# Altium project LMG5200.PrjPcb
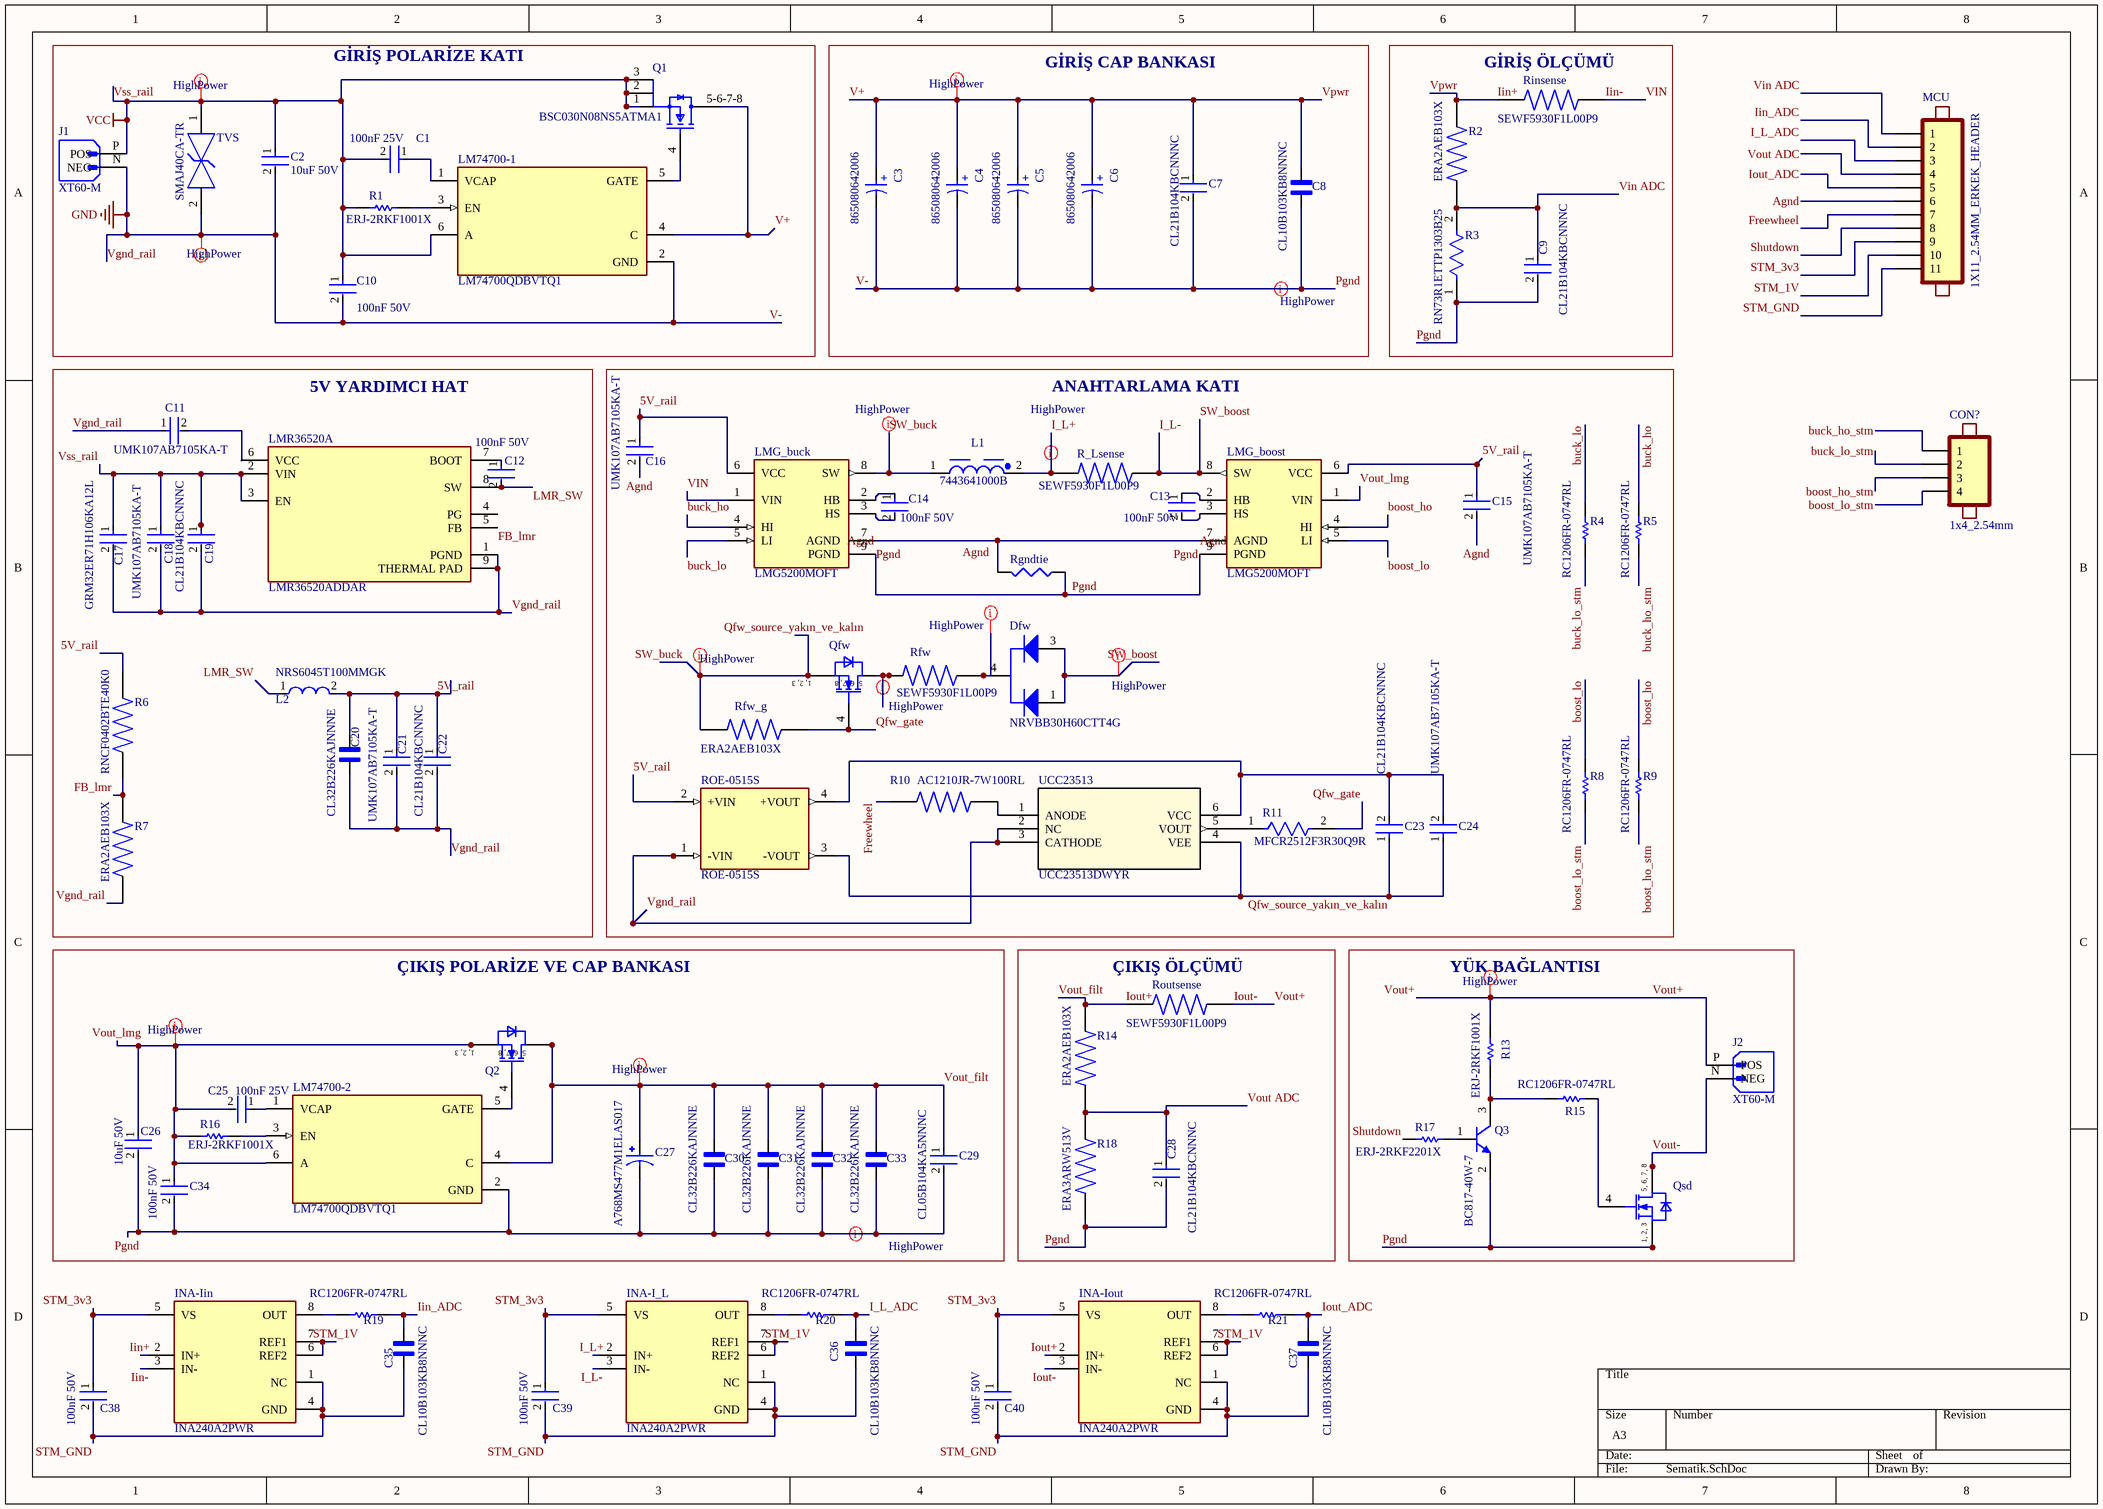
[diagram p0: Sematik.SchDoc]
1 sheet, 89 parts. Net scope: global (net labels, ports and power ports of the same name join across sheets).
Board file: PCB1.PcbDoc

## Sheet Sematik.SchDoc
size A3; SheetNumber: 1; SheetTotal: 1

### Parts
C1  100nF 25V  [FP-CL830-IPC_C]
C2  10uF 50V  [FP-CL31B106KBHNNNE-MFG]
C3  865080642006  [WCAP-ASLI_D5H5.5]
C4  865080642006  [WCAP-ASLI_D5H5.5]
C5  865080642006  [WCAP-ASLI_D5H5.5]
C6  865080642006  [WCAP-ASLI_D5H5.5]
C7  CL21B104KBCNNNC  [FP-CL21-IPC_C]
C8  CL10B103KB8NNNC  [CAPC1608X90N]
C9  CL21B104KBCNNNC  [FP-CL21-IPC_C]
C10  100nF 50V  [FP-CL21-IPC_C]
C11  UMK107AB7105KA-T  [FP-0603-L_1_6_0_15-W_0_8-IPC_C]
C12  100nF 50V  [FP-CL21-IPC_C]
C13  100nF 50V  [FP-CL21-IPC_C]
C14  100nF 50V  [FP-CL21-IPC_C]
C15  UMK107AB7105KA-T  [FP-0603-L_1_6_0_15-W_0_8-IPC_C]
C16  UMK107AB7105KA-T  [FP-0603-L_1_6_0_15-W_0_8-IPC_C]
C17  GRM32ER71H106KA12L  [FP-GRM32-MFG]
C18  UMK107AB7105KA-T  [FP-0603-L_1_6_0_15-W_0_8-IPC_C]
C19  CL21B104KBCNNNC  [FP-CL21-IPC_C]
C20  CL32B226KAJNNNE  [CAPC3225X270N]
C21  UMK107AB7105KA-T  [FP-0603-L_1_6_0_15-W_0_8-IPC_C]
C22  CL21B104KBCNNNC  [FP-CL21-IPC_C]
C23  CL21B104KBCNNNC  [FP-CL21-IPC_C]
C24  UMK107AB7105KA-T  [FP-0603-L_1_6_0_15-W_0_8-IPC_C]
C25  100nF 25V  [FP-CL830-IPC_C]
C26  10uF 50V  [FP-CL31B106KBHNNNE-MFG]
C27  A768MS477M1ELAS017  [CAPAE1030X1225N]
C28  CL21B104KBCNNNC  [FP-CL21-IPC_C]
C29  CL05B104KA5NNNC  [FP-CL830-IPC_C]
C30  CL32B226KAJNNNE  [CAPC3225X270N]
C31  CL32B226KAJNNNE  [CAPC3225X270N]
C32  CL32B226KAJNNNE  [CAPC3225X270N]
C33  CL32B226KAJNNNE  [CAPC3225X270N]
C34  100nF 50V  [FP-CL21-IPC_C]
C35  CL10B103KB8NNNC  [CAPC1608X90N]
C36  CL10B103KB8NNNC  [CAPC1608X90N]
C37  CL10B103KB8NNNC  [CAPC1608X90N]
C38  100nF 50V  [FP-CL21-IPC_C]
C39  100nF 50V  [FP-CL21-IPC_C]
C40  100nF 50V  [FP-CL21-IPC_C]
CON?  1x4_2.54mm  [HDR254M-1X4]
Dfw  NRVBB30H60CTT4G  [ONSC-D2PAK-3-418B-04_V]
INA-I_L  INA240A2PWR  [FP-PW0008A-MFG]
INA-Iin  INA240A2PWR  [FP-PW0008A-MFG]
INA-Iout  INA240A2PWR  [FP-PW0008A-MFG]
J1  XT60-M  [AMASS_XT60-M]
J2  XT60-M  [AMASS_XT60-M]
L1  7443641000B  [WE-HCF_2818]
L2  NRS6045T100MMGK  [FP-NR6045-MFG]
LM74700-1  LM74700QDBVTQ1  [FP-DBV0006A-MFG]
LM74700-2  LM74700QDBVTQ1  [FP-DBV0006A-MFG]
LMG_boost  LMG5200MOFT  [FP-MOF0009A-MFG]
LMG_buck  LMG5200MOFT  [FP-MOF0009A-MFG]
LMR36520A  LMR36520ADDAR  [FP-DDA0008E-IPC_A]
MCU  1X11_2.54MM_ERKEK_HEADER  [254HEADER_1x11_ERKEK_HEADER_180C]
Q1  BSC030N08NS5ATMA1  [FP-PG-TDSON-8-MFG]
Q2  BSC014N06NS  [INF-PG-TDSON-8-FL]  (value not drawn)
Q3  BC817-40W-7  [DIOD-SOT323-3_V]
Qfw  BSC014N06NS  [INF-PG-TDSON-8-FL]  (value not drawn)
Qsd  BSC014N06NS  [INF-PG-TDSON-8-FL]  (value not drawn)
R1  ERJ-2RKF1001X  [RESC1005X40X25NL05T05]
R2  ERA2AEB103X  [RES_ERA2AEB103X]
R3  RN73R1ETTP1303B25  [FP-RN73R1E-IPC_B]
R4  RC1206FR-0747RL  [RESC3116X65X40LL10T20]
R5  RC1206FR-0747RL  [RESC3116X65X40LL10T20]
R6  RNCF0402BTE40K0  [RESC1005X35N]
R7  ERA2AEB103X  [RES_ERA2AEB103X]
R8  RC1206FR-0747RL  [RESC3116X65X40LL10T20]
R9  RC1206FR-0747RL  [RESC3116X65X40LL10T20]
R10  AC1210JR-7W100RL  [RESC3126X65N]
R11  MFCR2512F3R30Q9R  [FP-RMCF2512-IPC_C]
R13  ERJ-2RKF1001X  [RESC1005X40X25NL05T05]
R14  ERA2AEB103X  [RES_ERA2AEB103X]
R15  RC1206FR-0747RL  [RESC3116X65X40LL10T20]
R16  ERJ-2RKF1001X  [RESC1005X40X25NL05T05]
R17  ERJ-2RKF2201X  [RESC1005X40X25LL05T05]
R18  ERA3ARW513V  [RES_ERA3ARW513V]
R19  RC1206FR-0747RL  [RESC3116X65X40LL10T20]
R20  RC1206FR-0747RL  [RESC3116X65X40LL10T20]
R21  RC1206FR-0747RL  [RESC3116X65X40LL10T20]
R_Lsense  SEWF5930F1L00P9  [RESC15077X155N]
Rfw  SEWF5930F1L00P9  [RESC15077X155N]
Rfw_g  ERA2AEB103X  [RES_ERA2AEB103X]
Rgndtie  (no value)  [RES_0402]
Rinsense  SEWF5930F1L00P9  [RESC15077X155N]
ROE-0515S  ROE-0515S  [CONV_ROE-0515S]
Routsense  SEWF5930F1L00P9  [RESC15077X155N]
TVS  SMAJ40CA-TR  [FP-SMA-MFG]
UCC23513  UCC23513DWYR  [DWY6_TEX]

### Blocks framed on the sheet
GİRİŞ POLARİZE KATI: C1 C2 C10 J1 LM74700-1 Q1 R1 TVS
GİRİŞ CAP BANKASI: C3-C8
GİRİŞ ÖLÇÜMÜ: C9 R2 R3 Rinsense
5V YARDIMCI HAT: C11 C12 C17-C22 L2 LMR36520A R6 R7
ANAHTARLAMA KATI: C13-C16 C23 C24 Dfw L1 LMG_boost LMG_buck Qfw R4 R5 R8-R11 R_Lsense Rfw Rfw_g Rgndtie ROE-0515S UCC23513
ÇIKIŞ POLARİZE VE CAP BANKASI: C25-C27 C29-C34 LM74700-2 Q2 R16
ÇIKIŞ ÖLÇÜMÜ: C28 R14 R18 Routsense
YÜK BAĞLANTISI: J2 Q3 Qsd R13 R15 R17

### Nets
Pgnd: C2.2 C3.2(N) C4.2(N) C5.2(N) C6.2(N) C7.2 C8.1 C9.2 C10.2 C11.1 C17.2 C18.2 C19.2 C20.1 C21.2 C22.2 C26.2 C27.2 C28.2 C29.2 C30.1 C31.1 C32.1 C33.1 C34.2 J1.N(NEG) LM74700-1.2(GND) LM74700-2.2(GND) LMG_boost.9(PGND) LMG_buck.9(PGND) LMR36520A.1(PGND) LMR36520A.9(THERMAL_PAD) Q3.2(E) Qsd.1(SOURCE) Qsd.2(SOURCE) Qsd.3(SOURCE) R3.1 R7.2 R18.1 Rgndtie.2(BOT) ROE-0515S.1(-VIN) TVS.2 UCC23513.2(NC) UCC23513.3(CATHODE)  [also labelled GND, V-, Vgnd_rail]
Vss_rail: C1.2 C2.1 C10.1 C17.1 C18.1 C19.1 J1.P(POS) LM74700-1.6(A) LMR36520A.2(VIN) LMR36520A.3(EN) Q1.1(S) Q1.2(S) Q1.3(S) R1.1 TVS.1  [also labelled VCC]
5V_rail: C15.1 C16.1 C20.2 C21.1 C22.1 L2.2 LMG_boost.6(VCC) LMG_buck.6(VCC) R6.2 ROE-0515S.2(+VIN)
Agnd: C15.2 C16.2 LMG_boost.7(AGND) LMG_buck.7(AGND) MCU.6 Rgndtie.1(TOP)
boost_ho: LMG_boost.4(HI) R9.1
boost_ho_stm: CON?.3 R9.2
boost_lo: LMG_boost.5(LI) R8.1
boost_lo_stm: CON?.4 R8.2
buck_ho: LMG_buck.4(HI) R5.1
buck_ho_stm: CON?.1 R5.2
buck_lo: LMG_buck.5(LI) R4.1
buck_lo_stm: CON?.2 R4.2
FB_lmr: LMR36520A.5(FB) R6.1 R7.1
Freewheel: MCU.7 R10.1
I_L+: INA-I_L.2(IN+) L1.2 R_Lsense.1
I_L-: Dfw.1(A1) Dfw.3(A2) INA-I_L.3(IN-) LMG_boost.8(SW) R_Lsense.2  [also labelled SW_boost]
I_L_ADC: C36.2 MCU.3 R20.2
Iin+: C3.1(P) C4.1(P) C5.1(P) C6.1(P) C7.1 C8.2 INA-Iin.2(IN+) LM74700-1.4(C) Q1.5-6-7-8(D) R2.2 Rinsense.1  [also labelled V+, Vpwr]
Iin-: INA-Iin.3(IN-) LMG_buck.1(VIN) Rinsense.2  [also labelled VIN]
Iin_ADC: C35.2 MCU.2 R19.2
Iout+: C27.1 C29.1 C30.2 C31.2 C32.2 C33.2 INA-Iout.2(IN+) LM74700-2.4(C) Q2.5(DRAIN) Q2.6(DRAIN) Q2.7(DRAIN) Q2.8(DRAIN) R14.2 Routsense.1  [also labelled Vout_filt]
Iout-: INA-Iout.3(IN-) J2.P(POS) R13.2 Routsense.2  [also labelled Vout+]
Iout_ADC: C37.2 MCU.5 R21.2
LMR_SW: C12.2 L2.1 LMR36520A.8(SW)
Qfw_gate: Qfw.4(GATE) R11.2 Rfw_g.1
Qfw_source_yakın_ve_kalın: C23.1 C24.1 L1.1 LMG_buck.8(SW) Qfw.1(SOURCE) Qfw.2(SOURCE) Qfw.3(SOURCE) Rfw_g.2 ROE-0515S.3(-VOUT) UCC23513.4(VEE)  [also labelled SW_buck]
Shutdown: MCU.8 R17.1
STM_1V: INA-I_L.6(REF2) INA-I_L.7(REF1) INA-Iin.6(REF2) INA-Iin.7(REF1) INA-Iout.6(REF2) INA-Iout.7(REF1) MCU.10
STM_3v3: C38.1 C39.1 C40.1 INA-I_L.5(VS) INA-Iin.5(VS) INA-Iout.5(VS) MCU.9
STM_GND: C35.1 C36.1 C37.1 C38.2 C39.2 C40.2 INA-I_L.1(NC) INA-I_L.4(GND) INA-Iin.1(NC) INA-Iin.4(GND) INA-Iout.1(NC) INA-Iout.4(GND) MCU.11
Vin ADC: C9.1 MCU.1 R2.1 R3.2
Vout ADC: C28.1 MCU.4 R14.1 R18.2
Vout-: J2.N(NEG) Qsd.5(DRAIN) Qsd.6(DRAIN) Qsd.7(DRAIN) Qsd.8(DRAIN)
Vout_lmg: C25.2 C26.1 C34.1 LM74700-2.6(A) LMG_boost.1(VIN) Q2.1(SOURCE) Q2.2(SOURCE) Q2.3(SOURCE) R16.1
NetC1_1: C1.1 LM74700-1.1(VCAP)
NetC11_2: C11.2 LMR36520A.6(VCC)
NetC12_1: C12.1 LMR36520A.7(BOOT)
NetC13_1: C13.1 LMG_boost.2(HB)
NetC13_2: C13.2 LMG_boost.3(HS)
NetC14_1: C14.1 LMG_buck.2(HB)
NetC14_2: C14.2 LMG_buck.3(HS)
NetC23_2: C23.2 C24.2 ROE-0515S.4(+VOUT) UCC23513.6(VCC)
NetC25_1: C25.1 LM74700-2.1(VCAP)
NetDfw_4: Dfw.4(K) Rfw.2
NetINA-I_L_8: INA-I_L.8(OUT) R20.1
NetINA-Iin_8: INA-Iin.8(OUT) R19.1
NetINA-Iout_8: INA-Iout.8(OUT) R21.1
NetLM74700-1_3: LM74700-1.3(EN) R1.2
NetLM74700-1_5: LM74700-1.5(GATE) Q1.4(G)
NetLM74700-2_3: LM74700-2.3(EN) R16.2
NetLM74700-2_5: LM74700-2.5(GATE) Q2.4(GATE)
NetQ3_1: Q3.1(B) R17.2
NetQ3_3: Q3.3(C) R13.1 R15.1
NetQfw_5: Qfw.5(DRAIN) Qfw.6(DRAIN) Qfw.7(DRAIN) Qfw.8(DRAIN) Rfw.1
NetQsd_4: Qsd.4(GATE) R15.2
NetR10_2: R10.2 UCC23513.1(ANODE)
NetR11_1: R11.1 UCC23513.5(VOUT)

Not connected (* = marked no-connect by the designer): LMR36520A 4(PG)

### Layout directives
net class HighPower: I_L+, I_L-, Iin+, Iout+, Iout-, NetDfw_4, NetQfw_5, Pgnd, Qfw_source_yakın_ve_kalın, Vout_lmg, Vss_rail

### Notes on the sheet
- Labels drawn without touching a wire or pin: Agnd, Pgnd
- (in symbol BSC014N06NS) 1, 2, 3; 5, 6, 7, 8
- (in symbol CMP-03913-53914615-2) +

### Library data of the parts
C1 C25 C29 = CMP-13271-001643-1: Cap Ceramic 100nF 25V X7R ±10% SMD 0402 +125°C Paper T/R; Case/Package: 0402; Voltage Rating: 25V; Capacitance: 100nF; Mount: Surface Mount; Voltage Rating (DC): 25V; Thickness: 0.022inch; Min Operating Temperature: -55°C; Width: 0.02inch; Tolerance: 10%; Packaging: Tape and Reel; Max Operating Temperature: 125°C; Length: 0.039inch; Case Code (Imperial): 0402; Case Code (Metric): 1005
C2 C26 = CMP-2000-07530-2: CAP CER 10UF 50V X7R 1206; Manufacturer: Samsung; Manufacturer Part Number: CL31B106KBHNNNE; Tolerance: 10%; Material: Ceramic; Temperature Coefficient: 15%; Temperature Characteristic: X7R; Digikey Description: CAP CER 10UF 50V X7R 1206; Device Class L1: Passive Components; Value: 10uF; Lead Free: Yes; Device Class L3: Ceramic Capacitors; Octopart: https://octopart.com/cl31b106kbhnnne-samsung-30507377; ComponentLink2URL: http://www.samsungsem.com/global/front/downloadcms.do?path=%2F%2Fglobal%2F%2Fsupport%2F%2Fproduct-search%2F%2Fmlcc%2F%2F__icsFiles%2F%2Fafieldfile%2F%2F2019%2F%2F06%2F%2F18&fileName=CL31B106KBHNNNE-19.pdf; Voltage Rating: 50V; Temperature Range Low: -55°C; RoHS: TRUE; Temperature: -55°C to +125°C; Category: Cap; ComponentLink2Description: Datasheet; Automotive: No; Device Class L2: Capacitors; Capacitance: 10uF; Height: 1.8mm; Temperature Range High: +125°C; Package: CL31B106KBHNNNE
C3-C6 = CMP-03913-53914615-2: Alum. Electrolytic Cap 10UF 50V, 5MM Surface Mount, Lifetime 2000H, +105OC; Impedance: 2.8Ω; Tolerance: 20%; Capacitance: 10µF; Ripple Current (AC): 95mA; Insulation Resistance: 10MΩ; Life (Hours): 2000hours; ESR (Equivalent Series Resistance): 1.63932Ω; Polarity: Polar; Leakage Current: 5µA; Case/Package: Radial; Max Operating Temperature: 105°C; Height: 5.5mm; Voltage Rating (DC): 50V; REACH SVHC: Unknown; Length: 5.5mm; Width: 5.3mm; Mount: Surface Mount; Min Operating Temperature: -55°C; Ripple Current: 95mA; Diameter: 5mm; RoHS: Compliant; Voltage Rating: 50V; Height - Seated (Max): 5.5118mm
C7 C9 C10 C12-C14 C19 C22 C23 C28 C34 C38-C40 = CMP-2000-05017-2: CL21 Series 0805 100nF 50V ±10% Tolerance X7R Multilayer Ceramic Chip Capacitor; Depth: 1.25mm; Height: 0.85mm; Width: 0.049inch; Tolerance: 10%; Case Code (Metric): 2012; Case Code (Imperial): 0805; Material: Ceramic; Thickness: 0.037inch; Min Operating Temperature: -55°C; Contact Plating: Tin; Length: 2mm; Mount: Surface Mount; Voltage Rating (DC): 50V; Lead Free: Lead Free; Dielectric: X7R; Radiation Hardening: No; Capacitance: 100nF; Voltage Rating: 50V; Case/Package: 0805; Packaging: Tape and Reel; Max Operating Temperature: 125°C; Voltage: 50V
C8 C35-C37 = CL10B103KB8NNNC: CL10 Series 10 nF 50 V Â±10 % Tolerance X7R SMT Multilayer Ceramic Capacitor; MF: Samsung Electro-Mechanics; SnapEDA_Link: https://www.snapeda.com/parts/CL10B103KB8NNNC/Samsung/view-part/?ref=snap; Package: SMD-2 Samsung; Value: *; MP: CL10B103KB8NNNC; Check_prices: https://www.snapeda.com/parts/CL10B103KB8NNNC/Samsung/view-part/?ref=eda
C11 C15 C16 C18 C21 C24 = CMP-2000-07531-4: Ceramic Capacitor General Use 1uF ±10% 50V X7R 0603; Series: M; Width: 0.031inch; Mount: Surface Mount; Radiation Hardening: No; Voltage Rating (DC): 50V; Packaging: Tape and Reel; Termination: SMD/SMT; Depth: 0.8mm; Case Code (Metric): 1608; Case Code (Imperial): 0603; Height: 0.8mm; Voltage Rating: 50V; Package Quantity: 1; Halogen Free: Halogen Free; Dielectric: X7R; Min Operating Temperature: -55°C; Length: 1.6mm; Construction: Flat; Tolerance: 10%; Thickness: 0.037inch; Max Operating Temperature: 125°C; Case/Package: 0603; Capacitance: 1uF; RoHS Compliant: Yes
C17 = CMP-2000-05261-2: CAP CER 10UF 50V X7R 1210; Manufacturer: Murata; Tolerance: 10%; Material: Ceramic; Temperature Coefficient: 15%; Voltage Rating: 50V; Temperature Characteristic: X7R; Value: 10uF; ComponentLink2Description: Datasheet; Device Class L1: Passive Components; Lead Free: Yes; Temperature Range High: +125°C; Category: Cap; Manufacturer Part Number: GRM32ER71H106KA12L; ComponentLink2URL: https://search.murata.co.jp/Ceramy/image/img/A01X/G101/ENG/GRM32ER71H106KA12-01.pdf; Device Class L2: Capacitors; Package: GRM32; Mouser Description: 1210 10 uF 50 V ±10% Tolerance X7R SMT Multilayer Ceramic Capacitor; Capacitance: 10uF; Octopart: https://octopart.com/grm32er71h106ka12l-murata-10470987; Digikey Description: CAP CER 10UF 50V X7R 1210; Height: 2.7mm; Temperature: -55°C to +125°C; Temperature Range Low: -55°C; RoHS: TRUE; Device Class L3: Ceramic Capacitors; Automotive: No
C20 = CL32B226KAJNNNE: 22 µF ±10% 25V Ceramic Capacitor X7R 1210 (3225 Metric); MF: Samsung Electro-Mechanics; SnapEDA_Link: https://www.snapeda.com/parts/CL32B226KAJNNNE/Samsung/view-part/?ref=snap; Package: SMD-2 Samsung; Value: *; MP: CL32B226KAJNNNE; Check_prices: https://www.snapeda.com/parts/CL32B226KAJNNNE/Samsung/view-part/?ref=eda
C27 = A768MS477M1ELAS017: MF: {'manufacturer': u'KEMET'}; Package: None; Price: None; Value: *; MP: A768MS477M1ELAS017; Availability: Unavailable
C30-C33 = CL32B226KAJNNNE: 22 ÂµF Â±10% 25V Ceramic Capacitor X7R 1210 (3225 Metric); MF: Samsung Electro-Mechanics; SnapEDA_Link: https://www.snapeda.com/parts/CL32B226KAJNNNE/Samsung/view-part/?ref=snap; Package: SMD-2 Samsung; Value: *; MP: CL32B226KAJNNNE; Check_prices: https://www.snapeda.com/parts/CL32B226KAJNNNE/Samsung/view-part/?ref=eda
CON? = 1X4_2.54MM_180C_ERKEK_HEADER(Lenght-Mating:6,1mm): MFN: HM0943; NAME: 1X4_2.54MM_180C_ERKEK_HEADER(Lenght-Mating:6,1mm); STOK KOD: *; TYPE: DIP
Dfw = CMP-1055-00116-1: SWITCHMODE(TM) Power Rectifier, 60 V, 30 A, 3-Pin D2PAK, Pb-Free, Tape and Reel; Manufacturer: On Semiconductor; IFSM Max (A): 260; Configuration: Common Cathode; Packing: Tape and Reel; PackageDescription: 3-Pin Flange Mount, Body 9.145 x 9.97 mm, Pitch 2.54 mm; PartNumber: NRVBB30H60CTT4G; PackageReference: D2PAK-3-418B-04; ComponentLink1Description: Manufacturer URL; ComponentLink3Description: Package Specification; RoHS: TRUE; DatasheetVersion: Rev. 10; PackageVersion: Rev. K, 09/2008; ComponentLink2URL: http://www.onsemi.cn/pub_link/Collateral/MBRB30H60CT-D.PDF; ComponentLink3URL: http://www.onsemi.com/pub_link/Collateral/418B-04.PDF; ComponentLink1URL: http://www.onsemi.com/; ComponentLink2Description: Datasheet; Mounting Technology: Surface Mount
INA-I_L INA-Iin INA-Iout = CMP-04895-000047-1: IC AMP CURRENT SENSE 8-TSSOP; Manufacturer: Texas Instruments; Voltage Gain: 0.05V/mV; Max Supply Voltage: 5.5V; Max Junction Temp: +150°C; Input Offset Voltage: 0.005mV; Bandwidth: 400kHz; Min Supply Voltage: 2.7V; Nominal Supply Current: 1.8mA; Standoff Height: 0.05mm; Number Of Channels: 1; Input Bias Current: 90uA; ComponentLink2URL: http://www.ti.com/lit/ds/symlink/ina240.pdf; Device Class L2: Linear ICs; ComponentLink2Description: Datasheet; Temperature: -40°C to +125°C; Octopart: https://octopart.com/ina240a2pwr-texas+instruments-75431049; Automotive: No; Manufacturer Part Number: INA240A2PWR; Ambient Temperature Range Low: -40°C; RoHS: TRUE; Package: PW0008A; Device Class L1: Integrated Circuits (ICs); Temperature Range Low: -40°C; Category: IC; Ipc Land Pattern Name: SOP65P300X120-8; Temperature Range High: +125°C; Ambient Temperature Range High: +125°C; Height: 1.2mm; Lead Free: Yes; Device Class L3: Instrumentation; Digikey Description: IC AMP CURRENT SENSE 8-TSSOP
J1 J2 = XT60-M: Plug; DC supply; XT60; male; PIN: 2; for cable; soldered; 30A; 500V; MF: AMASS; SnapEDA_Link: https://www.snapeda.com/parts/XT60-M/AMASS/view-part/?ref=snap; Package: Package; Value: *; MP: XT60-M; Check_prices: https://www.snapeda.com/parts/XT60-M/AMASS/view-part/?ref=eda
L1 = CMP-03913-99053231-3: ROHS3Compliant Wirewound Active Bulk Fixed Inductor -40C~125C 15MHz 0.968mOhm Max 10muH; Current Rating: 47.5A; DC Resistance (DCR): 880µΩ; Saturation Current: 22.9A; Inductance Tolerance: 20%; Inductance: 10µH; Length: 27mm; Height: 18.5mm; Ambient Temperature Range Low: -40°C; Max Operating Temperature: 125°C; RoHS: Compliant; Width: 28mm; Min Operating Temperature: -40°C; Ambient Temperature Range High: 75°C
L2 = CMP-14484-001321-1: Shielded Wirewound Inductor 10uH 20% 2.8A 59.8mΩ SMD; DC Resistance (DCR): 59.8mR; Test Frequency: 100kHz; Self Resonant Frequency: 12MHz; Core Material: Ferrite; Max DC Current: 3.1A; RMS Current (Irms): 2.4A; Inductance: 10uH; Length: 6mm; Height - Seated (Max): 0.177inch; Series: NRS; Min Operating Temperature: -25°C; Tolerance: 20%; Radiation Hardening: No; Halogen Free: Halogen Free; Shielding: Shielded; Resistor Type: Wirewound; Case/Package: Nonstandard; Number of Pins: 2; Package Quantity: 1500; Width: 0.236inch; Depth: 6.2mm; Max Operating Temperature: 125°C; Packaging: Tape and Reel; Lead Free: Lead Free; Mount: Surface Mount; RoHS Compliant: Yes; Height: 4.5mm; Lead Pitch: 4.7mm; Saturation Current: 3.1A; Termination: SMD/SMT; Current Rating: 2.4A; Inductance Tolerance: 20%
LM74700-1 LM74700-2 = CMP-04910-000068-1: LOW IQ, IDEAL DIODE CONTROLLER; Manufacturer: STMicroelectronics; Manufacturer Part Number: SMAJ40A-TR; Breakdown Voltage: 46.7V; Value: 370pF; Clamping Voltage: 64.5V; Direction: Unidirectional; Element Configuration: Single; Leakage Current: 200nA; Max Junction Temperature (Tj): 150°C; Max Power Dissipation: 3.3W; Max Repetitive Reverse Voltage (Vrrm): 40V; Max Surge Current: 1mA; Min Breakdown Voltage: 44.4V; Number of Elements: 1; Peak Pulse Current: 27A; Peak Pulse Power: 400W; Peak Reverse Current: 1µA; Power Line Protection: No; Ratings: MIL-STD-750; Max Operating Temperature: 125°C; Min Operating Temperature: -40°C; RoHS Compliant: Yes; Supplier: Farnell; Supplier Part Number: SMAJ40A-TR; RoHS: Compliant; Category: TVS Diodes; Stock: 5066; Pricing: 5=0,124, 50=0,122, 250=0,119, 1000=0,117, 3000=0,114 (EUR); Case/Package: SMA; China RoHS: Non-Compliant; Composition: Zener; Height: 2.45mm; Lead Free: Lead Free; Length: 4.6mm; Lifecycle Status: Production; Max Breakdown Voltage: 46.7V; Max Reverse Leakage Current: 200nA; Mounting Technology: Surface Mount; Pins: 2; Number of Terminals: 2; Number of Unidirectional Channels: 1; Operating Supply Voltage: 40V; Packaging: Cut Tape; Polarity: Unidirectional; Power Rating: 400W; Radiation Hardening: No; REACH SVHC: No; Reverse Breakdown Voltage: 44.4V; Reverse Standoff Voltage: 40V; Schedule B: 8541100080; Termination: SMD/SMT; Test Current: 1mA; Voltage Rating (DC): 40V; Width: 2.9mm; ComponentLink1URL: https://datasheet.octopart.com:443/SMAJ40A-TR-STMicroelectronics-datasheet-181245950.pdf?src-supplier=IHS; ComponentLink1Description: https://datasheet.octopart.com:443/SMAJ40A-TR-STMicroelectronics-datasheet-181245950.pdf?src-supplier=IHS; ComponentLink2URL: https://datasheet.octopart.com:443/SMAJ40A-TR-STMicroelectronics-datasheet-16486334.pdf?src-supplier=HQonline; ComponentLink2Description: https://datasheet.octopart.com:443/SMAJ40A-TR-STMicroelectronics-datasheet-16486334.pdf?src-supplier=HQonline; ComponentLink3URL: https://datasheet.octopart.com:443/SMAJ40A-TR-STMicroelectronics-datasheet-8755266.pdf?src-supplier=Newark; ComponentLink3Description: https://datasheet.octopart.com:443/SMAJ40A-TR-STMicroelectronics-datasheet-8755266.pdf?src-supplier=Newark; ComponentLink4URL: https://datasheet.octopart.com:443/SMAJ40A-TR-STMicroelectronics-datasheet-19666.pdf?src-supplier=DigiKey; ComponentLink4Description: https://datasheet.octopart.com:443/SMAJ40A-TR-STMicroelectronics-datasheet-19666.pdf?src-supplier=DigiKey; ComponentLink5URL: https://datasheet.octopart.com:443/SMAJ40A-TR-STMicroelectronics-datasheet-182739136.pdf?src-supplier=TME; ComponentLink5Description: https://datasheet.octopart.com:443/SMAJ40A-TR-STMicroelectronics-datasheet-182739136.pdf?src-supplier=TME; ComponentLink6URL: https://datasheet.octopart.com:443/SMAJ40A-TR-STMicroelectronics-datasheet-14047680.pdf?src-supplier=iiiC; ComponentLink6Description: https://datasheet.octopart.com:443/SMAJ40A-TR-STMicroelectronics-datasheet-14047680.pdf?src-supplier=iiiC; ComponentLink7URL: https://datasheet.octopart.com:443/SMAJ40A-TR-STMicroelectronics-datasheet-8393739.pdf?src-supplier=Farnell; ComponentLink7Description: https://datasheet.octopart.com:443/SMAJ40A-TR-STMicroelectronics-datasheet-8393739.pdf?src-supplier=Farnell; ComponentLink8URL: https://datasheet.octopart.com:443/SMAJ40A-TR-STMicroelectronics-datasheet-8325117.pdf?src-supplier=Farnell; ComponentLink8Description: https://datasheet.octopart.com:443/SMAJ40A-TR-STMicroelectronics-datasheet-8325117.pdf?src-supplier=Farnell; ComponentLink9URL: https://datasheet.octopart.com:443/SMAJ40A-TR-STMicroelectronics-datasheet-9626695.pdf?src-supplier=RS+(Formerly+Allied+Electronics); ComponentLink9Description: https://datasheet.octopart.com:443/SMAJ40A-TR-STMicroelectronics-datasheet-9626695.pdf?src-supplier=RS+(Formerly+Allied+Electronics)
LMG_boost LMG_buck = CMP-04912-000022-2: None; Output Current per Channel: 10A; Interface: Logic; Min Operating Temperature: -40°C; Mount: Surface Mount; Case/Package: QFN; RoHS Compliant: Yes; Packaging: Cut Tape; Max Operating Temperature: 125°C; Number of Pins: 9
LMR36520A = CMP-04918-000502-1: IC DC/DC BUCK CONVERTER 65V 2A
Q1 = CMP-32901-000135-1: MOSFET N-CH 80V 100A 8TDSON; Manufacturer: Infineon; Typ Forward Diode Voltage: 0.9V; Drain To Source Resistance: 2.6mΩ; Number Of Channels: 1; Input Capacitace At Vds: 4300pF @ 40V; Transconductance: 110S; Pulse Drain Current: 400A; Reverse Recovery Time: 54ns; Gate To Source Voltage: 20V; Power Dissipation: 2.5W; Threshold Vgs Max: 3.8V; Rthja Max: 50K/W; Turn On Delay Time: 20ns; Reverse Recovery Charge: 94nC; Continuous Drain Current: 22A; Max Junction Temp: +150°C; Gate Charge At Vgs: 61nC @ 10V; Turn Off Delay Time: 43ns; Max Forward Diode Voltage: 1.1V; Depletion Mode: False; Threshold Vgs Min: 2.2V; Footprint Url: https://www.infineon.com/cms/en/product/packages/PG-TDSON/PG-TDSON-8-7/; Device Class L3: MOSFETs; Number Of N Channels: 1; Height: 1.1mm; Digikey Description: MOSFET N-CH 80V 100A 8TDSON; Octopart: https://octopart.com/bsc030n08ns5atma1-infineon-52825708; ComponentLink2URL: https://www.infineon.com/dgdl/Infineon-BSC030N08NS5-DS-v02_02-EN.pdf?fileId=5546d4624ad04ef9014aed52f4210acf; Category: Trans; Drain To Source Voltage: 80V; Package: PG-TDSON-8; Drain To Source Breakdown Voltage: 80V; Mouser Description: BSC030N08NS5ATMA1 N-Channel MOSFET, 100 A, 80 V BSC030N08NS5, 8-Pin TDSON Infineon; ComponentLink2Description: Datasheet; Device Class L1: Discrete Semiconductors; Device Class L2: Transistors; Automotive: No; Manufacturer Part Number: BSC030N08NS5ATMA1; RoHS: TRUE; Temperature Range Low: -55°C; Temperature: -55°C to +150°C; Lead Free: Yes; Temperature Range High: +150°C; Supplier: Farnell; Supplier Part Number: SMAJ40A-TR
Q2 Qfw Qsd = BSC014N06NS: OptiMOS Power - MOSFET, 60 V; Manufacturer: Infineon Technologies; ManufacturerPartNumber: BSC014N06NS; PackageReference: PG-TDSON-8 FL
Q3 = CMP-2000-05934-1: NPN Small Signal Transistor, 45 V, 500 mA, -65 to 150 degC, 3-Pin SOT323, RoHS, Tape and Reel; Manufacturer: DiodesIncorporated; Configuration: Single; Collector- Emitter Voltage VCEO Max: 45V; Emitter- Base Voltage VEBO: 5V; DC Collector/Base Gain hfe Min: 250; Collector-Emitter Saturation Voltage: 0.7V; Collector- Base Voltage VCBO: 50V; Maximum DC Collector Current: 1A; Pd - Power Dissipation: 200mW; Gain Bandwidth Product fT: 100MHz; Unit Weight: 0.000282oz; Series: BC817; Datasheet Version: Rev. 5-2, 01/2014; Datasheet URL: http://www.diodes.com/_files/datasheets/ds30575.pdf; Manufacturer URL: http://www.diodes.com/; Length: 2.2mm; Mounting Style: SMD/SMT; Maximum Operating Temperature: +150C; Package Description: 3-Pin Small Outline Transistor, Body 2 x 1.25 mm, Pitch 0.65 mm; Width: 1.35mm; RoHS: True; Minimum Operating Temperature: -65C; Brand: DiodesIncorporated; Product Category: BipolarTransistors-BJT; Height: 1mm; Factory Pack Quantity: 3000; Package / Case: SOT-23; Packaging: Reel; Transistor Polarity: NPN; Mounting Technology: SurfaceMount; Package Reference: SOT323
R1 R13 R16 = CMP-1011-00510-4: Chip Resistor, 1 KOhm, +/- 1%, 100 mW, -55 to 155 degC, 0402 (1005 Metric), RoHS, Tape and Reel; Manufacturer: Basic Passives; Voltage Rating: 50 V; Case\/Package: 0402; Resistance: 1 KOhm; Power Rating: 100 mW; PartNumber: ERJ-2RKF1001X; DatasheetVersion: 04/2015; Radiation Hardening: No; Pins: 2; Height: 0.35 mm; RoHSCompliant: true; Case Code (Imperial): 0402; ComponentLink2Description: Datasheet; ComponentLink1Description: Manufacturer URL; PackageReference: 0402; Mount: Surface Mount; Package Quantity: 10000; Tolerance: 1%; ComponentLink1URL: http://www.panasonic.com/; PackageDescription: 2-Pin Surface Mount Device, Body 1 x 0.5 mm; Mounting Technology: Surface Mount; Case Code (Metric): 1005; ComponentLink2URL: http://industrial.panasonic.com/cdbs/www-data/pdf/RDA0000/AOA0000C86.pdf; REACH SVHC: Yes; Packaging: Tape and Reel; Max Operating Temperature: 155 degC; Min Operating Temperature: -55 degC; Width: 0.5 mm; Length: 1 mm
R2 R7 R14 Rfw_g = ERA2AEB103X: 10 kOhms 0.1% 0.063W, 1/16W Chip Resistor 0402 (1005 Metric) Automotive AEC-Q200 Thin Film; MP: ERA-2AEB103X; MF: Panasonic; SnapEDA_Link: https://www.snapeda.com/parts/ERA-2AEB103X/Panasonic%20Electronic%20Components/view-part/372014/?ref=snap; Value: *; Package: 1005-2 Panasonic; Digi-Key_Part_Number: P10KDCCT-ND; Check_prices: https://www.snapeda.com/parts/ERA-2AEB103X/Panasonic%20Electronic%20Components/view-part/372014/?ref=eda
R3 = CMP-04015-027314-1: 130kΩ ±0.1% 0.063W, 1/16W Chip Resistor 0402 (1005 Metric) Moisture Resistant Thin Film
R4 R5 R8 R9 R15 R19-R21 = CMP-2000-06970-1: Chip Resistor, 47 Ohm, +/- 1%, 250 mW, -55 to 155 degC, 1206 (3216 Metric), RoHS, Tape and Reel; Unit Weight: 0.000571oz; Voltage Rating: 200V; Brand: Yageo; Resistance: 47Ohms; Power Rating: 250mW(1/4W); Temperature Coefficient: 100PPM/C; Tolerance: 1%; Product Category: ThickFilmResistors; Product: ThickFilmResistorsGeneralPurpose; Package / Case: 1206(3216metric); Operating Temperature Range: -55Cto+155C; Width: 1.6mm; Case Code - mm: 3216; Manufacturer: Yageo; Type: GeneralPurposeChipResistors; Mounting Technology: SurfaceMount; Package Reference: 1206; Length: 3.2mm; Case Code - in: 1206; Package Description: 2-Pin Surface Mount Device, Body 3.1 x 1.6 mm; Datasheet Version: Rev. 7, 05/2017; Height: 0.55mm; Manufacturer URL: http://www.yageo.com/; Series: RC1206; Packaging: Reel; Termination Style: SMD/SMT; Datasheet URL: http://www.yageo.com/documents/recent/PYu-RC_Group_51_RoHS_L_7.pdf; RoHS: True
R6 = RNCF0402BTE40K0: 40kOhm; Price: None; Availability: Unavailable; Package: None; MP: RNCF0402BTE40K0; Value: *
R10 = AC1210JR-7W100RL: RES 100 OHM 5% 1W 1210; MF: YAGEO; SnapEDA_Link: https://www.snapeda.com/parts/AC1210JR-7W100RL/Yageo/view-part/?ref=snap; Package: None; Value: *; MP: AC1210JR-7W100RL; Check_prices: https://www.snapeda.com/parts/AC1210JR-7W100RL/Yageo/view-part/?ref=eda
R11 = CMP-26527-001073-1: 3.3Ω 2512; Power Rating: 1W; Tolerance: 5%; Temperature Coefficient: 200ppm/°C; Resistance: 13kR; Case/Package: 2512; Case Code (Imperial): 2512; Resistor Type: Thick Film; Contact Plating: Tin; Number of Terminations: 2; Military Standard: Not; Case Code (Metric): 6432; Min Operating Temperature: -55°C; Length: 0.248inch; RoHS Compliant: Yes; Features: Automotive AEC-Q200; Construction: Rectangular; Radiation Hardening: No; Max Operating Temperature: 155°C; Height: 0.028inch; Mount: Surface Mount; Width: 0.126inch; Packaging: Tape and Reel; Max Power Dissipation: 1W; Series: RMCF; Depth: 3.2mm
R17 = CMP-2002-01132-2: Precision Thick Film Chip Resistor, 2.2 kOhm, 100 mW, 1%, -55 to 155 degC, 2-Pin SMD (0402), RoHS, Tape and Reel; Manufacturer: Panasonic; Resistance: 2.2kO; Temp Coefficient: ±100ppm/°C; Rated Power: 0.1W; Datasheet URL: https://datasheet.ciiva.com/11821/0900766b80f80784-11821273.pdf; Tolerance (%): ±1%; Mounting Technology: SurfaceMount; Package Description: 2-Pin Surface Mount Device, Body 1 x 0.5 mm; Manufacturer URL: http://www.panasonic.com/; Datasheet Version: 03/2011; Package Reference: 0402; Size Code: 0402
R_Lsense Rinsense Routsense = PSR500HTQFD0L30: 1 mOhms ±1% 5W Chip Resistor Nonstandard Automotive AEC-Q200, Current Sense Metal Element; MF: Rohm; SnapEDA_Link: https://www.snapeda.com/parts/PSR500HTQFD0L30/Rohm/view-part/?ref=snap; Package: 15077 ROHM; Value: *; MP: PSR500HTQFD0L30; Check_prices: https://www.snapeda.com/parts/PSR500HTQFD0L30/Rohm/view-part/?ref=eda
Rfw = PSR500HTQFD0L30: 0.3 mOhms Â±1% 10W Chip Resistor Nonstandard Automotive AEC-Q200, Current Sense Metal Element; MF: Rohm; SnapEDA_Link: https://www.snapeda.com/parts/PSR500HTQFD0L30/Rohm/view-part/?ref=snap; Package: 15077 ROHM; Value: *; MP: PSR500HTQFD0L30; Check_prices: https://www.snapeda.com/parts/PSR500HTQFD0L30/Rohm/view-part/?ref=eda
Rgndtie = RES SMD 0 OHM 5% 1/16W 0402: MFN: RC0402JR-070RL; STOK KOD: HM0523; NAME: RES SMD 0 OHM 5% 1/16W 0402; TYPE: SMD
ROE-0515S = ROE-0515S: 1W DC/DC-Converter 'ECONOLINE' SIP4 1kV unreg; MF: Recom Power; Package: SIP-4 Recom Power; Purchase-URL: https://pricing.snapeda.com/search/part/ROE-0515S/?ref=eda; MP: ROE-0515S; Price: None; SnapEDA_Link: https://www.snapeda.com/parts/ROE-0515S/Recom%20Power/view-part/3121306/?ref=snap; Check_prices: https://www.snapeda.com/parts/ROE-0515S/Recom%20Power/view-part/3121306/?ref=eda; Value: *; Availability: Warning
TVS = CMP-12225-000052-1: TVS DIODE 40V 84V SMA; Manufacturer: STMicroelectronics; Number Of Channels: 2; Breakdown Voltage: 44.4V; Max Junction Temp: +150°C; Standoff Height: 0.05mm; Peak Pulse Power: 400W; Clamping Voltage: 64.5V; Direction: Bidirectional; Peak Pulse Current: 6.2A; Temperature Range Low: -55°C; Height: 2.65mm; Category: Diode; Lead Free: Yes; ComponentLink2URL: https://www.st.com/resource/en/datasheet/smaj.pdf; Octopart: https://octopart.com/smaj40ca-tr-stmicroelectronics-55428666; Manufacturer Part Number: SMAJ40CA-TR; Device Class L2: TVS Diodes; Temperature: -55°C to +150°C; Automotive: No; Temperature Range High: +150°C; Digikey Description: TVS DIODE 40V 84V SMA; Device Class L3: unset; Reverse Standoff Voltage: 40V; ComponentLink2Description: Datasheet; Package: SMA; Mouser Description: Transient Voltage Suppressor, Tvs, Transil Smaj Series, Bidirectional, 40 V, Smd, 2, 44.4 V; Device Class L1: Circuit Protection; RoHS: TRUE
UCC23513 = UCC23513DWYR: 5.7kVrms, 4A/5A single-channel opto-compatible isolated gate driver with 8 & 12V UVLO options 6-SOIC -40 to 125; Manufacturer_Name: Texas Instruments; Copyright: Copyright (C) 2026 Ultra Librarian. All rights reserved.; Manufacturer_Part_Number: UCC23513DWYR; RefDes: RefDes; Type: Type
R18 = ERA3ARW513V: Package: None; Value: *; Availability: Unavailable; MP: ERA3ARW513V; Price: None